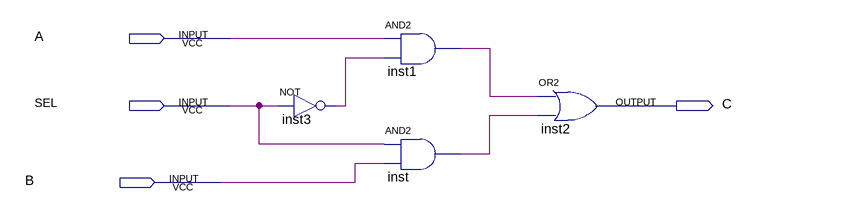
[diagram p0: schematic sheet]
// Quartus schematic MUX1BITS2WAY.bdf as structural Verilog: 4 symbols, 4 pins
module MUX1BITS2WAY (
  input  A,
  input  SEL,
  input  B,
  output C
);

  wire inst1_out, inst3_out, inst_out;

  not inst3 (inst3_out, SEL);
  and inst1 (inst1_out, A, inst3_out);
  and inst (inst_out, SEL, B);
  or inst2 (C, inst1_out, inst_out);
endmodule
